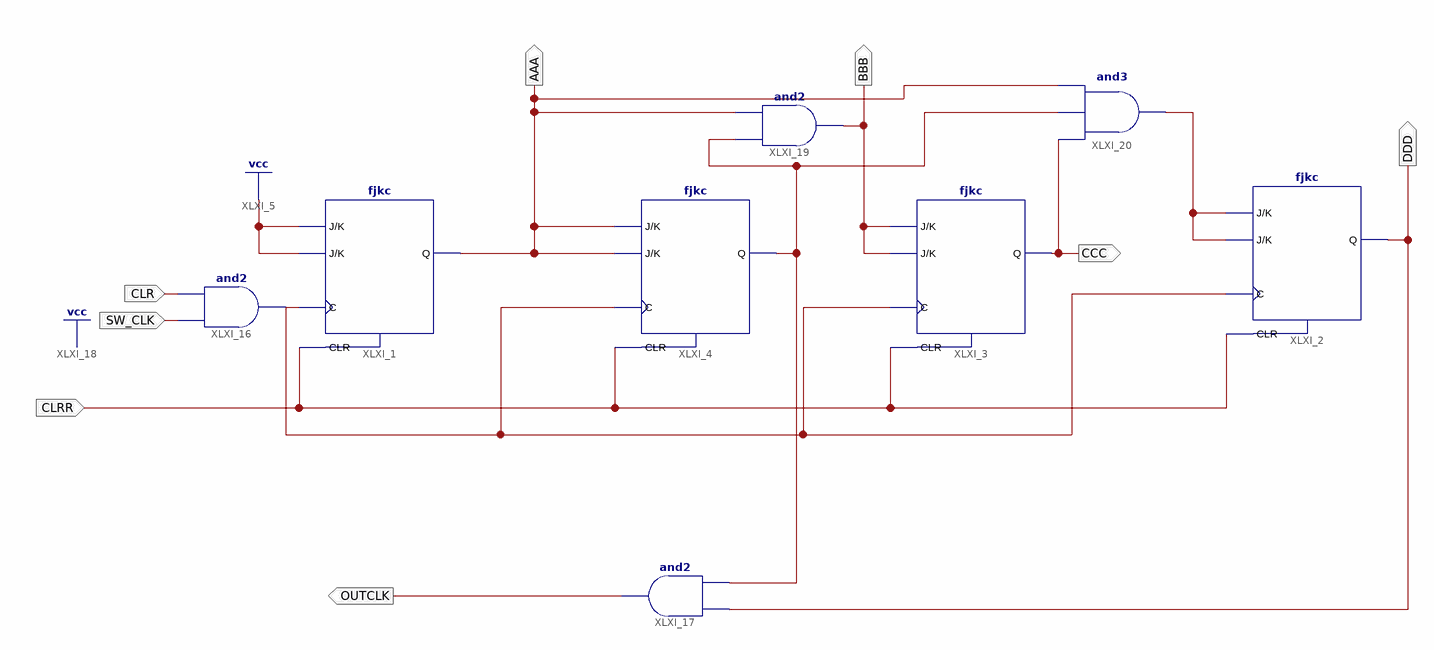
[diagram p0: schematic sheet 1]
// Xilinx ISE schematic ZERONINE.sch (spartan6) as structural Verilog: 8 symbols, 8 ports
module ZERONINE (
  input  CLR,
  input  SW_CLK,
  input  CLRR,
  output OUTCLK,
  output DDD,
  output AAA,
  output BBB,
  output CCC
);

  wire XLXN_16, XLXN_44, XLXN_49;

  fjkc XLXI_1 (.C(XLXN_16), .CLR(CLRR), .J(1'b1), .K(1'b1), .Q(AAA));
  fjkc XLXI_2 (.C(XLXN_16), .CLR(CLRR), .J(XLXN_49), .K(XLXN_49), .Q(DDD));
  fjkc XLXI_3 (.C(XLXN_16), .CLR(CLRR), .J(BBB), .K(BBB), .Q(CCC));
  fjkc XLXI_4 (.C(XLXN_16), .CLR(CLRR), .J(AAA), .K(AAA), .Q(XLXN_44));
  and XLXI_16 (XLXN_16, SW_CLK, CLR);
  and XLXI_17 (OUTCLK, XLXN_44, DDD);
  and XLXI_19 (BBB, XLXN_44, AAA);
  and XLXI_20 (XLXN_49, CCC, XLXN_44, AAA);
endmodule
